# EAGLE schematic singleGateFromLibrary (EAGLE 7.4.0)
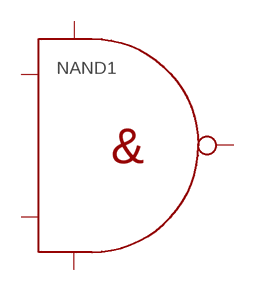
[diagram p0: schematic, sheet 1]

## Parts
NAND1  NAND  [NAND]
Unconnected: NAND1.A NAND1.B NAND1.NAND NAND1.V+ NAND1.V-

## Library data of the parts
NAND1 = p.peter-gator:NAND